# Altium schematic sheet buffers_5bits.SchDoc
size A4
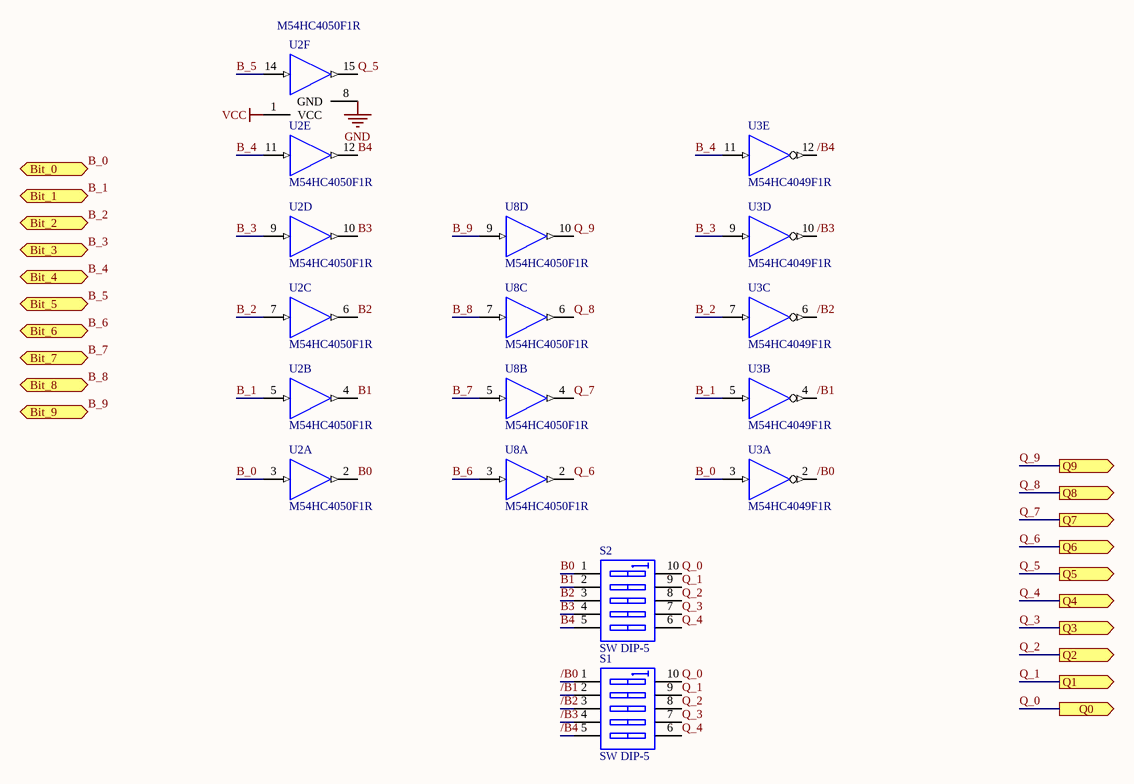
[diagram p0: buffers_5bits.SchDoc]

## Parts
S1  SW DIP-5  [N10A]
S2  SW DIP-5  [N10A]
U2  M54HC4050F1R  [DIP16]  (parts A,B,C,D,E,F of 6)
U3  M54HC4049F1R  [DIP16]  (parts A,B,C,D,E of 6)
U8  M54HC4050F1R  [DIP16]  (parts A,B,C,D of 6)

## Ports
Bit_0 (in), Bit_1 (in), Bit_2 (in), Bit_3 (in), Bit_4 (in), Bit_5 (in), Bit_6 (in), Bit_7 (in), Bit_8 (in), Bit_9 (in), Q0 (out), Q1 (out), Q2 (out), Q3 (out), Q4 (out), Q5 (out), Q6 (out), Q7 (out), Q8 (out), Q9 (out)

## Nets
GND: U2.8(GND) U3.8(GND) U8.8(GND)
VCC: U2.1(VCC) U3.1(VCC) U8.1(VCC)
/B0: S1.1(A1) U3.2(Y)
/B1: S1.2(A2) U3.4(Y)
/B2: S1.3(A3) U3.6(Y)
/B3: S1.4(A4) U3.10(Y)
/B4: S1.5(A5) U3.12(Y)
B0: S2.1(A1) U2.2(Y)
B1: S2.2(A2) U2.4(Y)
B2: S2.3(A3) U2.6(Y)
B3: S2.4(A4) U2.10(Y)
B4: S2.5(A5) U2.12(Y)
B_0: U2.3(A) U3.3(A) ; port Bit_0
B_1: U2.5(A) U3.5(A) ; port Bit_1
B_2: U2.7(A) U3.7(A) ; port Bit_2
B_3: U2.9(A) U3.9(A) ; port Bit_3
B_4: U2.11(A) U3.11(A) ; port Bit_4
B_5: U2.14(A) ; port Bit_5
B_6: U8.3(A) ; port Bit_6
B_7: U8.5(A) ; port Bit_7
B_8: U8.7(A) ; port Bit_8
B_9: U8.9(A) ; port Bit_9
Q_0: S1.10(B1) S2.10(B1) ; port Q0
Q_1: S1.9(B2) S2.9(B2) ; port Q1
Q_2: S1.8(B3) S2.8(B3) ; port Q2
Q_3: S1.7(B4) S2.7(B4) ; port Q3
Q_4: S1.6(B5) S2.6(B5) ; port Q4
Q_5: U2.15(Y) ; port Q5
Q_6: U8.2(Y) ; port Q6
Q_7: U8.4(Y) ; port Q7
Q_8: U8.6(Y) ; port Q8
Q_9: U8.10(Y) ; port Q9

## Library data of the parts
S1 S2 = SW DIP-5: DIP Switch, 5 Position, SPST; Published: 24-Mar-1999; LatestRevisionDate: 17-Jul-2002; LatestRevisionNote: Re-released for DXP Platform.; PackageReference: N10A; Publisher: Altium Limited
U2 U8 = M54HC4050F1R: Hex Buffer/Converter Non-Inverting; Note: Pins 13 and 16 are not connected and not drawn.; Published: 8-Jun-2000; LatestRevisionDate: 06-Jun-2005; LatestRevisionNote: Stylized 3D Model Added.; DatasheetVersion: Mar-1993; PackageVersion: Apr-1996; PackageReference: DIP16; Publisher: Altium Limited; PackageDescription: DIP; 16 Leads; Row Spacing 7.62 mm; Pitch 2.54 mm; ComponentLink1Description: Manufacturer Link; ComponentLink1URL: http://www.st.com/
U3 = M54HC4049F1R: Hex Buffer/Converter Invertering; Note: Pins 13 and 16 are not connected and not drawn.; Published: 8-Jun-2000; LatestRevisionDate: 06-Jun-2005; LatestRevisionNote: Stylized 3D Model Added.; DatasheetVersion: Mar-1993; PackageVersion: Apr-1996; PackageReference: DIP16; Publisher: Altium Limited; PackageDescription: DIP; 16 Leads; Row Spacing 7.62 mm; Pitch 2.54 mm; ComponentLink1Description: Manufacturer Link; ComponentLink1URL: http://www.st.com/